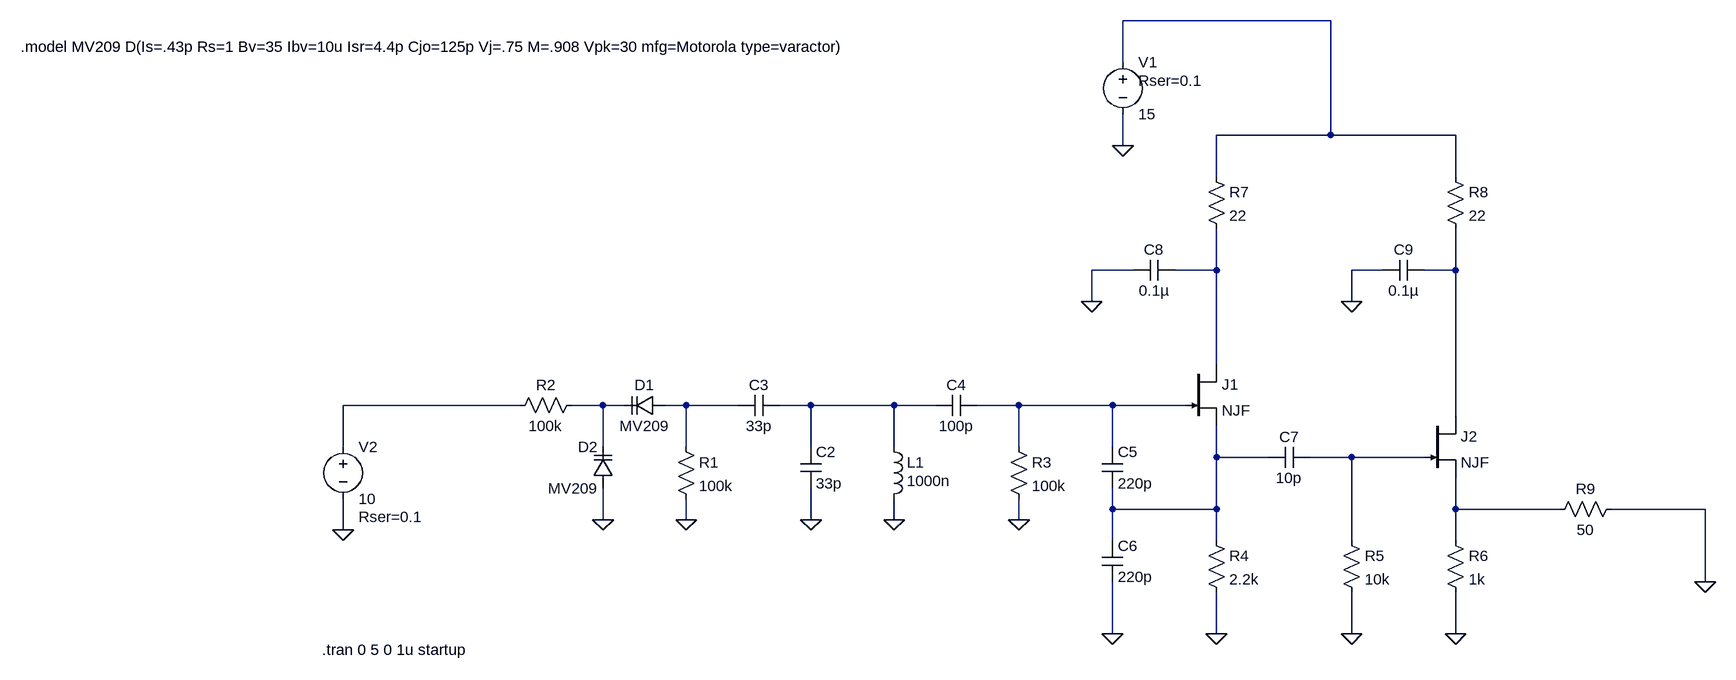
[diagram p0: schematic linear_vco.asc]
linear_vco.asc, the LTspice schematic file:
Version 4
SHEET 1 2116 680
WIRE 1296 -528 976 -528
WIRE 976 -464 976 -528
WIRE 1296 -352 1296 -528
WIRE 1296 -352 1120 -352
WIRE 1488 -352 1296 -352
WIRE 976 -336 976 -384
WIRE 1120 -288 1120 -352
WIRE 1488 -288 1488 -352
WIRE 992 -144 928 -144
WIRE 1120 -144 1120 -208
WIRE 1120 -144 1056 -144
WIRE 1376 -144 1328 -144
WIRE 1488 -144 1488 -208
WIRE 1488 -144 1440 -144
WIRE 928 -96 928 -144
WIRE 1328 -96 1328 -144
WIRE 1120 0 1120 -144
WIRE 48 64 -224 64
WIRE 176 64 128 64
WIRE 208 64 176 64
WIRE 304 64 272 64
WIRE 384 64 304 64
WIRE 496 64 448 64
WIRE 624 64 496 64
WIRE 688 64 624 64
WIRE 816 64 752 64
WIRE 960 64 816 64
WIRE 1072 64 960 64
WIRE 1488 80 1488 -144
WIRE -224 128 -224 64
WIRE 176 128 176 64
WIRE 304 128 304 64
WIRE 496 128 496 64
WIRE 624 128 624 64
WIRE 816 128 816 64
WIRE 960 128 960 64
WIRE 1120 144 1120 96
WIRE 1200 144 1120 144
WIRE 1328 144 1264 144
WIRE 1440 144 1328 144
WIRE 960 224 960 192
WIRE 1120 224 1120 144
WIRE 1120 224 960 224
WIRE 1488 224 1488 176
WIRE 1648 224 1488 224
WIRE 1872 224 1728 224
WIRE 176 240 176 192
WIRE 304 240 304 208
WIRE 496 240 496 192
WIRE 624 240 624 208
WIRE 816 240 816 208
WIRE -224 256 -224 208
WIRE 960 272 960 224
WIRE 1120 272 1120 224
WIRE 1328 272 1328 144
WIRE 1488 272 1488 224
WIRE 1872 336 1872 224
WIRE 960 416 960 336
WIRE 1120 416 1120 352
WIRE 1328 416 1328 352
WIRE 1488 416 1488 352
FLAG 176 240 0
FLAG 304 240 0
FLAG 496 240 0
FLAG 624 240 0
FLAG 816 240 0
FLAG 960 416 0
FLAG 1120 416 0
FLAG 1328 416 0
FLAG 1488 416 0
FLAG 928 -96 0
FLAG 1328 -96 0
FLAG 976 -336 0
FLAG -224 256 0
FLAG 1872 336 0
SYMBOL res 288 112 R0
SYMATTR InstName R1
SYMATTR Value 100k
SYMBOL cap 480 128 R0
SYMATTR InstName C2
SYMATTR Value 33p
SYMBOL ind 608 112 R0
WINDOW 3 36 68 Left 2
SYMATTR Value 1000n
SYMATTR InstName L1
SYMATTR SpiceLine Ipk=0.4 Rser=0.672 Rpar=94.2 Cpar=0 mfg="Coilcraft" pn="0603AF-102"
SYMBOL cap 448 48 R90
WINDOW 0 0 32 VBottom 2
WINDOW 3 32 32 VTop 2
SYMATTR InstName C3
SYMATTR Value 33p
SYMBOL res 144 48 R90
WINDOW 0 0 56 VBottom 2
WINDOW 3 32 56 VTop 2
SYMATTR InstName R2
SYMATTR Value 100k
SYMBOL cap 752 48 R90
WINDOW 0 0 32 VBottom 2
WINDOW 3 32 32 VTop 2
SYMATTR InstName C4
SYMATTR Value 100p
SYMBOL res 800 112 R0
SYMATTR InstName R3
SYMATTR Value 100k
SYMBOL cap 944 128 R0
SYMATTR InstName C5
SYMATTR Value 220p
SYMBOL cap 944 272 R0
SYMATTR InstName C6
SYMATTR Value 220p
SYMBOL res 1104 256 R0
SYMATTR InstName R4
SYMATTR Value 2.2k
SYMBOL cap 1264 128 R90
WINDOW 0 0 32 VBottom 2
WINDOW 3 32 32 VTop 2
SYMATTR InstName C7
SYMATTR Value 10p
SYMBOL res 1312 256 R0
SYMATTR InstName R5
SYMATTR Value 10k
SYMBOL res 1472 256 R0
SYMATTR InstName R6
SYMATTR Value 1k
SYMBOL cap 1056 -160 R90
WINDOW 0 0 32 VBottom 2
WINDOW 3 32 32 VTop 2
SYMATTR InstName C8
SYMATTR Value 0.1µ
SYMBOL cap 1440 -160 R90
WINDOW 0 0 32 VBottom 2
WINDOW 3 32 32 VTop 2
SYMATTR InstName C9
SYMATTR Value 0.1µ
SYMBOL res 1104 -304 R0
SYMATTR InstName R7
SYMATTR Value 22
SYMBOL res 1472 -304 R0
SYMATTR InstName R8
SYMATTR Value 22
SYMBOL voltage 976 -480 R0
WINDOW 123 0 0 Left 0
WINDOW 39 24 44 Left 2
SYMATTR SpiceLine Rser=0.1
SYMATTR InstName V1
SYMATTR Value 15
SYMBOL voltage -224 112 R0
WINDOW 123 0 0 Left 0
WINDOW 39 24 124 Left 2
SYMATTR SpiceLine Rser=0.1
SYMATTR InstName V2
SYMATTR Value 10
SYMBOL varactor 272 48 R90
WINDOW 0 0 32 VBottom 2
WINDOW 3 32 32 VTop 2
SYMATTR InstName D1
SYMATTR Value MV209
SYMBOL varactor 192 192 R180
WINDOW 0 24 64 Left 2
WINDOW 3 24 0 Left 2
SYMATTR InstName D2
SYMATTR Value MV209
SYMBOL njf 1072 0 R0
SYMATTR InstName J1
SYMBOL njf 1440 80 R0
SYMATTR InstName J2
SYMBOL res 1744 208 R90
WINDOW 0 0 56 VBottom 2
WINDOW 3 32 56 VTop 2
SYMATTR InstName R9
SYMATTR Value 50
TEXT -256 440 Left 2 !.tran 0 5 0 1u startup
TEXT -720 -488 Left 2 !.model MV209 D(Is=.43p Rs=1 Bv=35 Ibv=10u Isr=4.4p Cjo=125p Vj=.75 M=.908 Vpk=30 mfg=Motorola type=varactor)

The netlist it stands for:
* linear_vco.asc
R1 N006 0 100k
C2 N007 0 33p
L1 N007 0 1000n Ipk=0.4 Rser=0.672 Rpar=94.2 Cpar=0 mfg="Coilcraft" pn="0603AF-102"
C3 N007 N006 33p
R2 N005 N004 100k
C4 N008 N007 100p
R3 N008 0 100k
C5 N008 N009 220p
C6 N009 0 220p
R4 N009 0 2.2k
C7 N010 N009 10p
R5 N010 0 10k
R6 N011 0 1k
C8 N002 0 0.1µ
C9 N003 0 0.1µ
R7 N001 N002 22
R8 N001 N003 22
V1 N001 0 15 Rser=0.1
V2 N004 0 10 Rser=0.1
D1 N006 N005 MV209
D2 0 N005 MV209
J1 N002 N008 N009 NJF
J2 N003 N010 N011 NJF
R9 0 N011 50
.model D D
.lib standard.dio
.model NJF NJF
.model PJF PJF
.lib standard.jft
.tran 0 5 0 1u startup
.model MV209 D(Is=.43p Rs=1 Bv=35 Ibv=10u Isr=4.4p Cjo=125p Vj=.75 M=.908 Vpk=30 mfg=Motorola type=varactor)
.backanno
.end